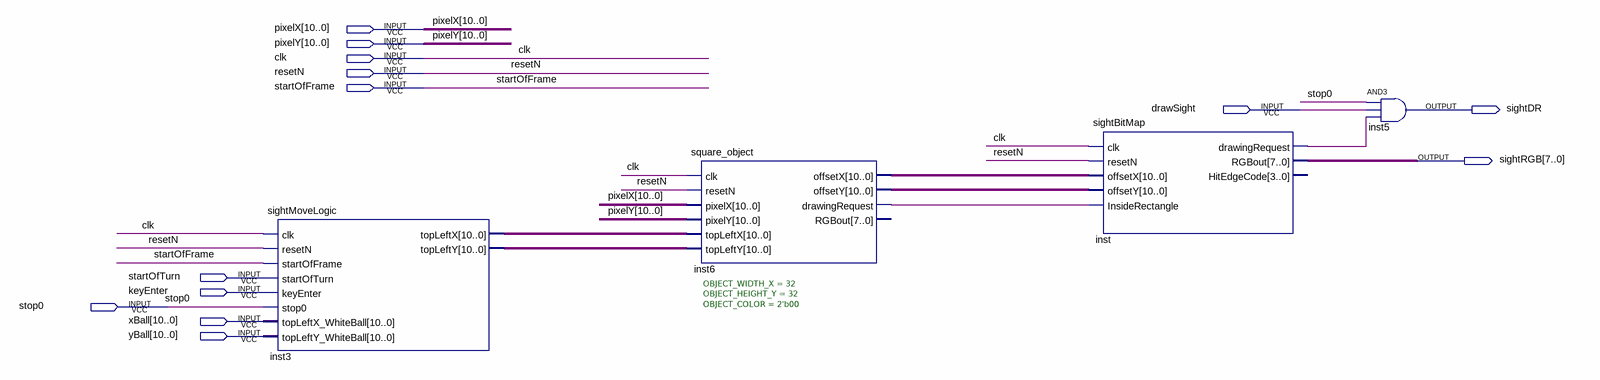
[diagram p0: schematic sheet]
// Quartus schematic sightDisplay.bdf as structural Verilog: 4 symbols, 13 pins
module sightDisplay (
  input  [10:0] pixelX,
  input  [10:0] pixelY,
  input  clk,
  input  resetN,
  input  startOfFrame,
  input  drawSight,
  input  startOfTurn,
  input  keyEnter,
  input  stop0,
  input  [10:0] xBall,
  input  [10:0] yBall,
  output sightDR,
  output [7:0] sightRGB
);

  wire inst6_drawingrequest, inst_drawingrequest;
  wire [10:0] inst3_topleftx, inst3_toplefty, inst6_offsetx, inst6_offsety;

  sightMoveLogic inst3 (
    .clk(clk), .resetN(resetN), .startOfFrame(startOfFrame), .startOfTurn(startOfTurn), .keyEnter(keyEnter),
    .stop0(stop0), .topLeftX_WhiteBall(xBall), .topLeftY_WhiteBall(yBall), .topLeftX(inst3_topleftx),
    .topLeftY(inst3_toplefty));
  square_object #(.OBJECT_WIDTH_X(32), .OBJECT_HEIGHT_Y(32), .OBJECT_COLOR(2'b00)) inst6 (
    .clk(clk), .resetN(resetN), .pixelX(pixelX), .pixelY(pixelY), .topLeftX(inst3_topleftx),
    .topLeftY(inst3_toplefty), .offsetX(inst6_offsetx), .offsetY(inst6_offsety),
    .drawingRequest(inst6_drawingrequest));  // open: RGBout
  sightBitMap inst (
    .clk(clk), .resetN(resetN), .offsetX(inst6_offsetx), .offsetY(inst6_offsety),
    .InsideRectangle(inst6_drawingrequest), .drawingRequest(inst_drawingrequest), .RGBout(sightRGB));  // open: HitEdgeCode
  and inst5 (sightDR, stop0, drawSight, inst_drawingrequest);
endmodule
